# Altium project VYLT_IOT_BATTPACK.PrjPcb
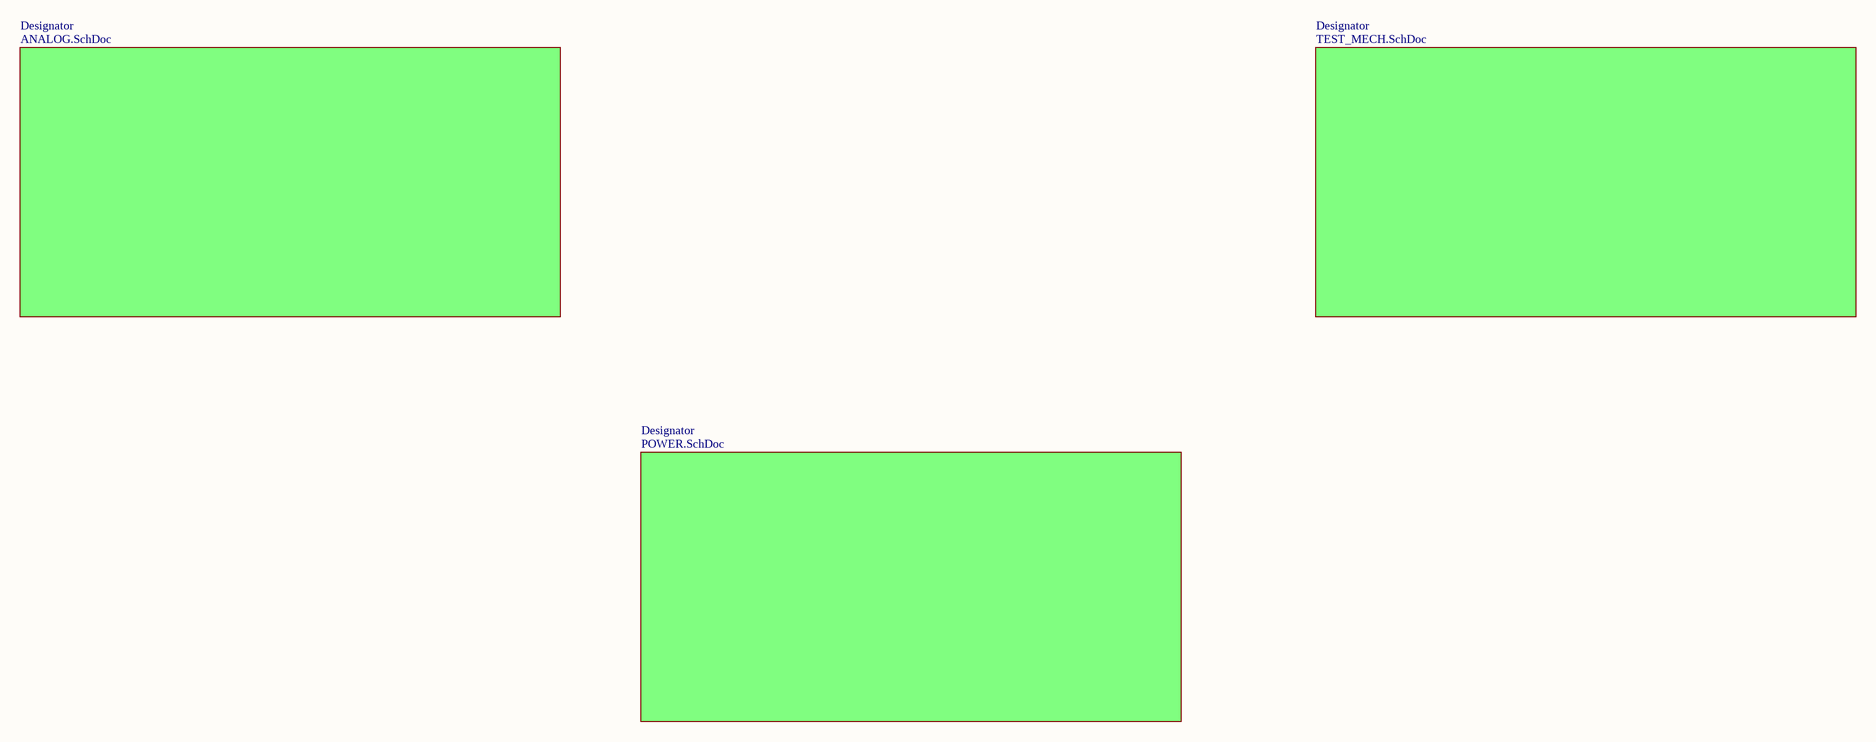
[diagram p0: ARCHITECTURE.SchDoc]
Project: VYLT_IOT_BATTPACK; Rev: 1.0; SheetTotal: 4
2 sheets, 53 parts. Net scope: global (net labels, ports and power ports of the same name join across sheets).
Board file: VYLT_IOT_BATTPACK.PcbDoc
Sheets:
  ARCHITECTURE.SchDoc
    Designator = POWER.SchDoc

## Sheet ARCHITECTURE.SchDoc: Architecture
size 420 x 297 mm; Revision: 1.0; SheetNumber: 1

### Sub-sheets
Designator = TEST_MECH.SchDoc (file not in this document): no entries
Designator = ANALOG.SchDoc (file not in this document): no entries
Designator = POWER.SchDoc: no entries

### Notes on the sheet
- PROJECT
- SIZE
- FILE NAME
- A3
- TITLE
- SHEET
- OF
- REV

## Sheet POWER.SchDoc: Power Supply
size 420 x 297 mm; Revision: 1.0; SheetNumber: 2; SheetTotal: 10
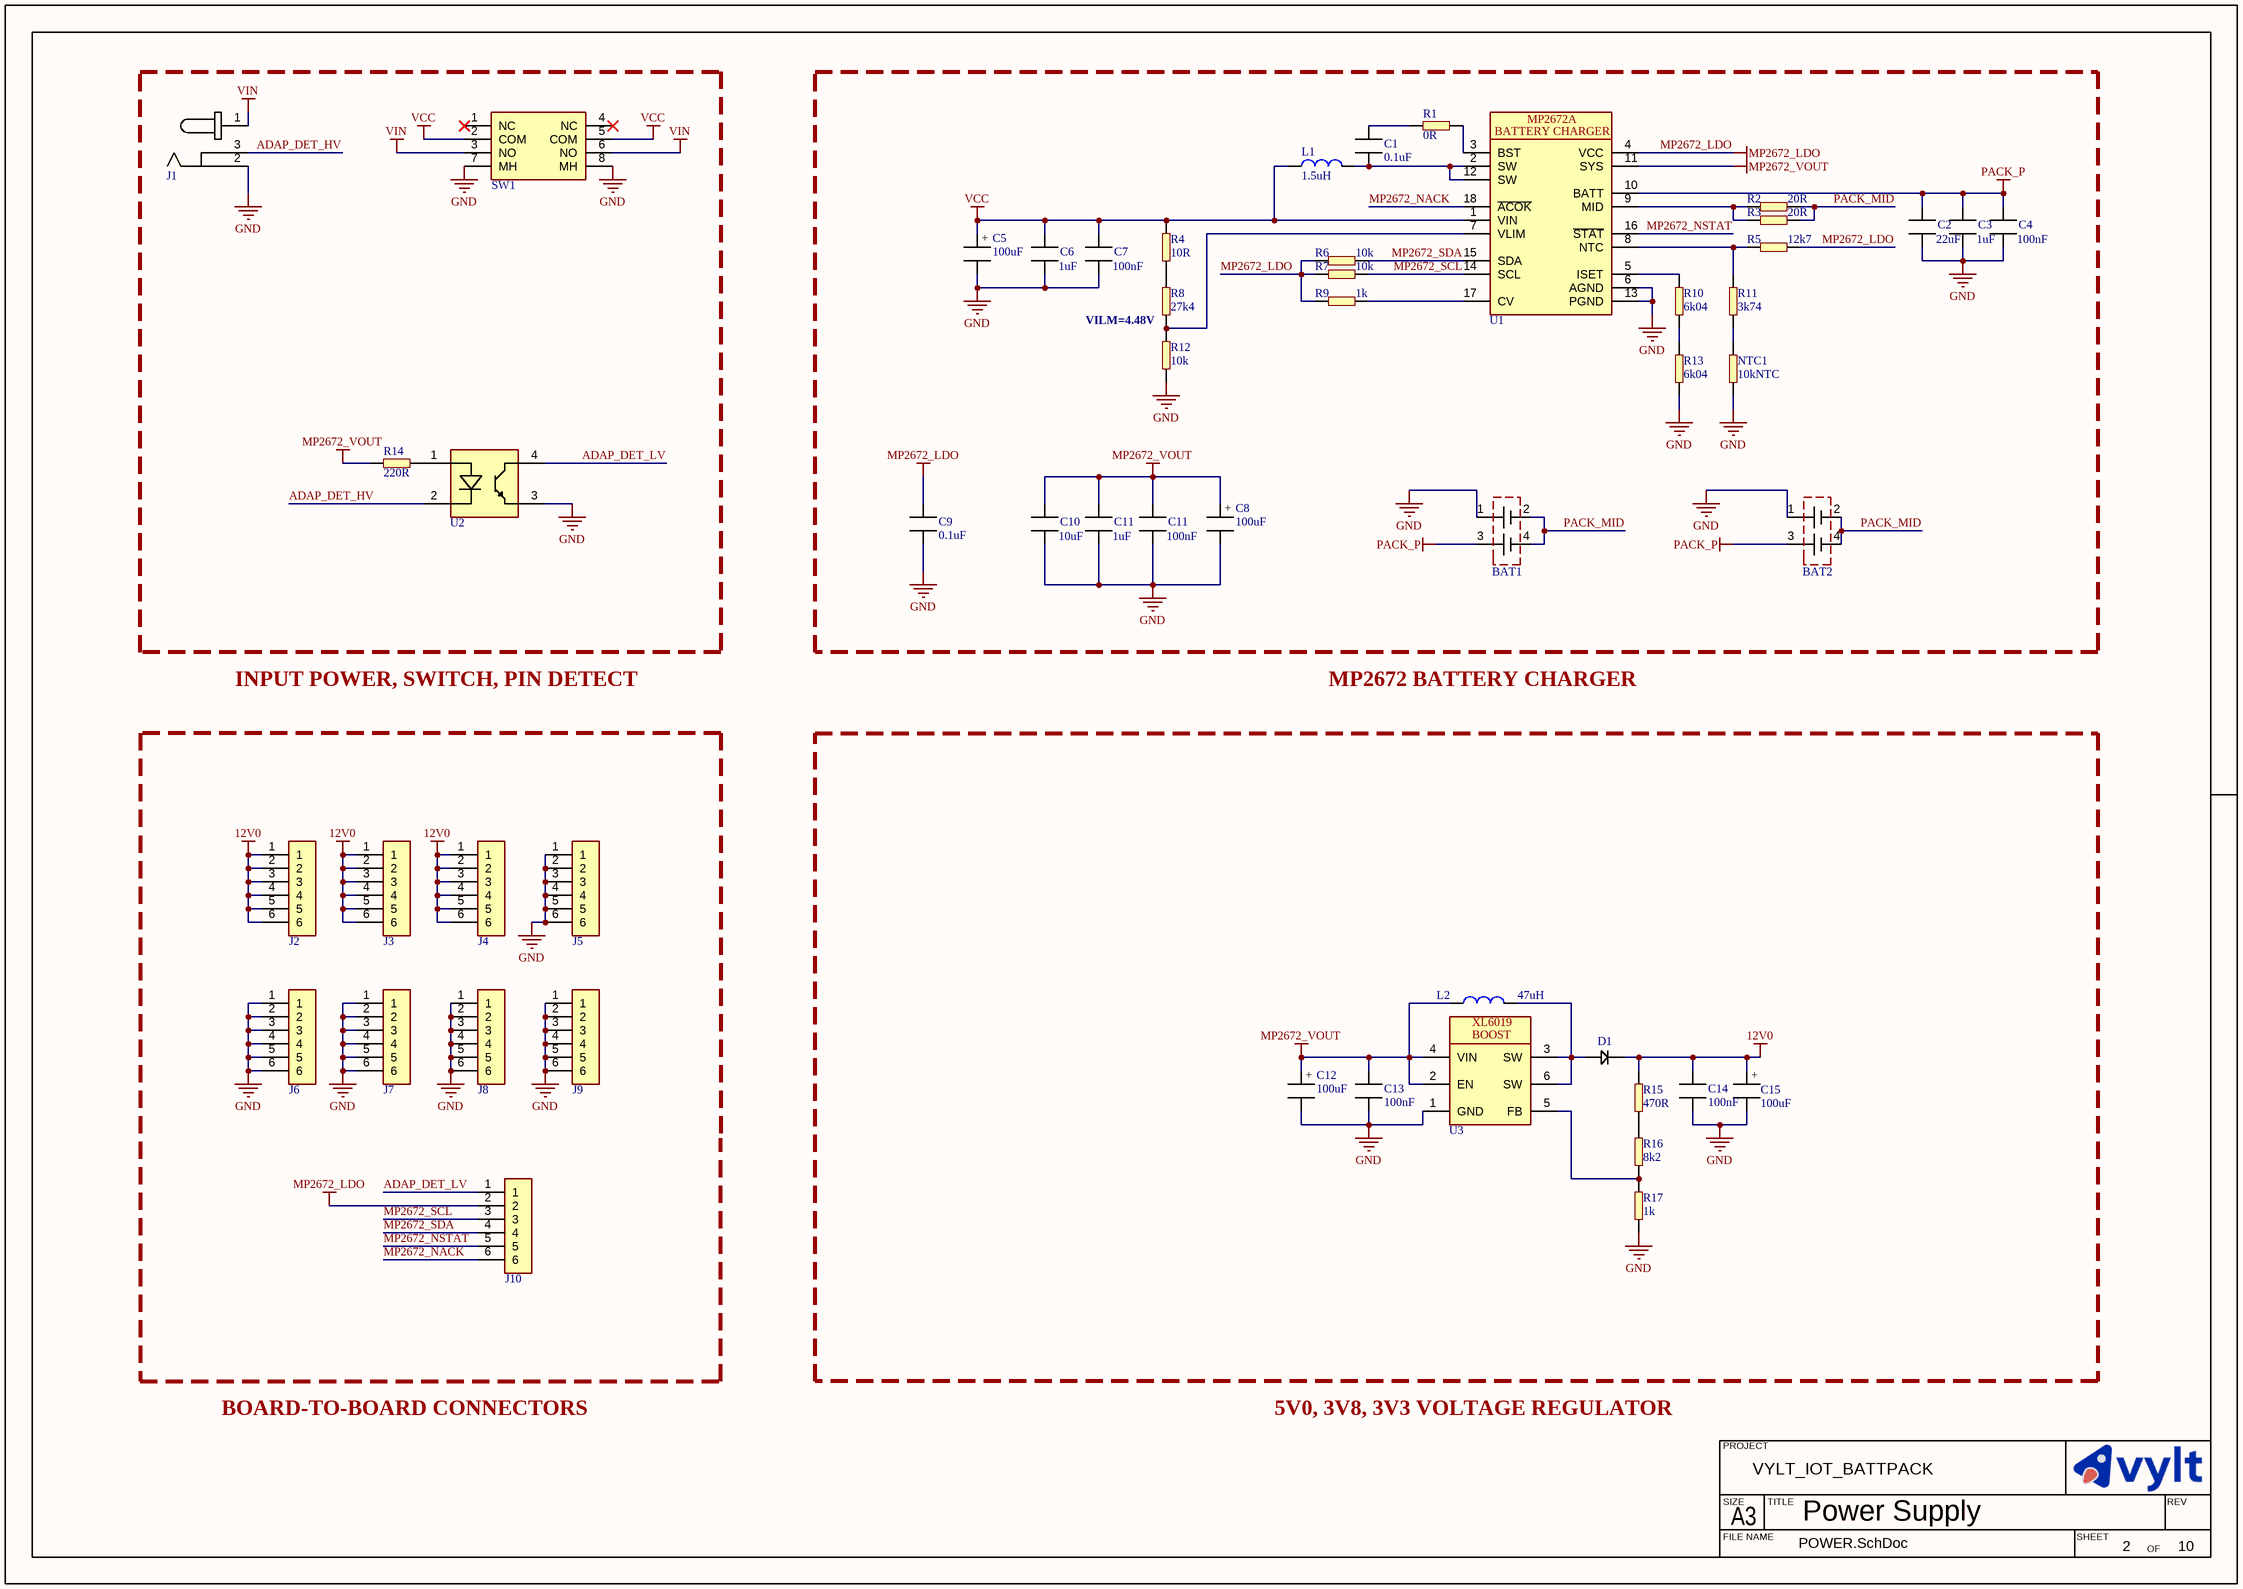
[diagram p1: POWER.SchDoc]

### Parts
(Parts that share a designator on the sheet are numbered #1, #2 ... from top to bottom, then left to right.)
BAT1  1049  [1049]  (value not drawn)
BAT2  1049  [1049]  (value not drawn)
C1  value 0.1uF  [CAPC1608X10N]  (hidden comment: MLCC_0603)
C2  value 22uF  [CAPC2012X13L]  (hidden comment: MLCC_0805)
C3  value 1uF  [CAPC2012X13L]  (hidden comment: MLCC_0805)
C4  value 100nF  [CAPC2012X13L]  (hidden comment: MLCC_0805)
C5  value 100uF  [CAP_6.3_7.7]  (hidden comment: ERP_102-2)
C6  value 1uF  [CAPC2012X13L]  (hidden comment: MLCC_0805)
C7  value 100nF  [CAPC2012X13L]  (hidden comment: MLCC_0805)
C8  value 100uF  [CAP_6.3_7.7]  (hidden comment: ERP_102-2)
C9  value 0.1uF  [CAPC1608X10N]  (hidden comment: MLCC_0603)
C10  value 10uF  [CAPC2012X13L]  (hidden comment: MLCC_0805)
C11#1  value 1uF  [CAPC2012X13L]  (hidden comment: MLCC_0805)
C11#2  value 100nF  [CAPC2012X13L]  (hidden comment: MLCC_0805)  (graphical)
C12  value 100uF  [CAP_6.3_7.7]  (hidden comment: ERP_102-2)
C13  value 100nF  [CAPC1608X10N]  (hidden comment: MLCC_0603)
C14  value 100nF  [CAPC1608X10N]  (hidden comment: MLCC_0603)
C15  value 100uF  [CAP_6.3_7.7]  (hidden comment: ERP_102-2)
D1  ERP_104-3  [DIOM6959X26L]  (value not drawn)
J1  KLDX-0202-AC  [KLDX-0202-AC]  (value not drawn)
J2  ERP_148-2  [6PX1R_F]  (value not drawn)
J3  ERP_148-2  [6PX1R_F]  (value not drawn)
J4  ERP_148-2  [6PX1R_F]  (value not drawn)
J5  ERP_148-2  [6PX1R_F]  (value not drawn)
J6  ERP_148-2  [6PX1R_F]  (value not drawn)
J7  ERP_148-2  [6PX1R_F]  (value not drawn)
J8  ERP_148-2  [6PX1R_F]  (value not drawn)
J9  ERP_148-2  [6PX1R_F]  (value not drawn)
J10  ERP_148-2  [6PX1R_F]  (value not drawn)
L1  value 1.5uH  [IND_7040]  (hidden comment: IND_7040)
L2  value 47uH  [IND_1212]  (hidden comment: IND_1212)
NTC1  value 10kNTC  [RES_NTC_BEAD]  (hidden comment: RES_NTC_BEAD)
R1  value 0R  [RES_0603]  (hidden comment: ERP_101-1)
R2  value 20R  [RESC3115X06N]  (hidden comment: ERP_101-1)
R3  value 20R  [RESC3115X06N]  (hidden comment: ERP_101-1)
R4  value 10R  [RES_0603]  (hidden comment: ERP_101-1)
R5  value 12k7  [RES_0603]  (hidden comment: ERP_101-1)
R6  value 10k  [RES_0603]  (hidden comment: ERP_101-1)
R7  value 10k  [RES_0603]  (hidden comment: ERP_101-1)
R8  value 27k4  [RES_0603]  (hidden comment: ERP_101-1)
R9  value 1k  [RES_0603]  (hidden comment: ERP_101-1)
R10  value 6k04  [RES_0603]  (hidden comment: ERP_101-1)
R11  value 3k74  [RES_0603]  (hidden comment: ERP_101-1)
R12  value 10k  [RES_0603]  (hidden comment: ERP_101-1)
R13  value 6k04  [RES_0603]  (hidden comment: ERP_101-1)
R14  value 220R  [RES_0603]  (hidden comment: ERP_101-1)
R15  value 470R  [RES_0603]  (hidden comment: ERP_101-1)
R16  value 8k2  [RES_0603]  (hidden comment: ERP_101-1)
R17  value 1k  [RES_0603]  (hidden comment: ERP_101-1)
SW1  ERP_110-4  [PBH2U]  (value not drawn)
U1  MP2672AGD  [MP2672AGD]  (value not drawn)
U2  FOD817A3SD  [FOD817A3SD]  (value not drawn)
U3  XL6019  [DPAK171P1524X483-6M]  (value not drawn)

### Blocks framed on the sheet
VILM=4.48V: BAT1 BAT2 C1-C10 C11#1 C11#2 L1 NTC1 R1-R13 U1

### Nets
12V0: C14.1 C15.1 D1.1(C) J2.1 J2.2 J2.3 J2.4 J2.5 J2.6 J3.1 J3.2 J3.3 J3.4 J3.5 J3.6 J4.1 J4.2 J4.3 J4.4 J4.5 J4.6 R15.1
GND: BAT1.1(+) BAT2.1(+) C2.2 C3.2 C4.2 C5.2 C6.2 C7.2 C8.2 C9.2 C10.2 C11#1.2 C11#2.2 C12.2 C13.2 C14.2 C15.2 J1.2 J5.1 J5.2 J5.3 J5.4 J5.5 J5.6 J6.1 J6.2 J6.3 J6.4 J6.5 J6.6 J7.1 J7.2 J7.3 J7.4 J7.5 J7.6 J8.1 J8.2 J8.3 J8.4 J8.5 J8.6 J9.1 J9.2 J9.3 J9.4 J9.5 J9.6 NTC1.1 R12.1 R13.1 R17.2 SW1.7(MH) SW1.8(MH) U1.6(AGND) U1.13(PGND) U2.3(EMITTER) U3.1(GND)
MP2672_LDO: C9.1 J10.2 R5.1 R6.1 R7.1 R9.1 U1.4(VCC)
MP2672_VOUT: C8.1 C10.1 C11#1.1 C11#2.1 C12.1 C13.1 L2.1 R14.1 U1.11(SYS) U3.2(EN) U3.4(VIN)
PACK_P: BAT1.3(+) BAT2.3(+) C2.1 C3.1 C4.1 U1.10(BATT)
VCC: C5.1 C6.1 C7.1 L1.1 R4.2 SW1.2(COM) SW1.5(COM) U1.1(VIN)
VIN: J1.1 SW1.3(NO) SW1.6(NO)
ADAP_DET_HV: J1.3 U2.2(CATHODE)
ADAP_DET_LV: J10.1 U2.4(COLLECTOR)
MP2672_NACK: J10.6 U1.18(~{ACOK})
MP2672_NSTAT: J10.5 U1.16(~{STAT})
MP2672_SCL: J10.3 R7.2 U1.14(SCL)
MP2672_SDA: J10.4 R6.2 U1.15(SDA)
PACK_MID: BAT1.2(-) BAT1.4(-) BAT2.2(-) BAT2.4(-) R2.1 R3.1
NetC1_1: C1.1 R1.1
NetC1_2: C1.2 L1.2 U1.2(SW) U1.12(SW)
NetD1_2: D1.2(A) L2.2 U3.3(SW) U3.6(SW)
NetNTC1_2: NTC1.2 R11.1
NetR1_2: R1.2 U1.3(BST)
NetR2_2: R2.2 R3.2 U1.9(MID)
NetR4_1: R4.1 R8.2
NetR5_2: R5.2 R11.2 U1.8(NTC)
NetR8_1: R8.1 R12.2 U1.7(VLIM)
NetR9_2: R9.2 U1.17(CV)
NetR10_1: R10.1 R13.2
NetR10_2: R10.2 U1.5(ISET)
NetR14_2: R14.2 U2.1(ANODE)
NetR15_2: R15.2 R16.1
NetR16_2: R16.2 R17.1 U3.5(FB)

Not connected (* = marked no-connect by the designer): SW1 1(NC)* 4(NC)*

### Notes on the sheet
- INPUT POWER, SWITCH, PIN DETECT
- MP2672 BATTERY CHARGER
- BOARD-TO-BOARD CONNECTORS
- 5V0, 3V8, 3V3 VOLTAGE REGULATOR
- PROJECT
- SIZE
- FILE NAME
- A3
- TITLE
- SHEET
- OF
- REV
- (in symbol CAP_6.3_7.7) +
- (in symbol MP2672AGD) MP2672A; BATTERY CHARGER
- (in symbol XL6019) BOOST

### Library data of the parts
BAT1 BAT2 = 1049: BATT HOLDER 18650 2 CELL PC PIN; Manufacturer 1: Keystone Electronics; Value: *; Manufacturer Part Number 1: 1049
C1 C9 C13 C14 = MLCC_0603: Chip Capacitor, 2-Leads, Body 1.60x0.80mm, IPC Medium Density; Package: 0603; Manufacturer 1: *; Manufacturer Part Number 1: *; Supplier 1: *; Suuplier Part Number 1: *; ERP: *
C2-C4 C6 C7 C10 C11#1 C11#2 = MLCC_0805: Chip Capacitor, 2-Leads, Body 2.00x1.25mm, IPC High Density; Package: 0805; Manufacturer 1: *; Manufacturer Part Number 1: *
C5 C8 = CAP_6.3_7.7: Electrolytic Capacitor SMD 6.3x7.7; ERP: 1; Package: 6.3x7.7; Manufacturer 1: *; Manufacturer Part Number 1: *; Supplier 1: *; Suuplier Part Number 1: *
C12 C15 = CAP_6.3_7.7: Electrolytic Capacitor SMD 6.3x7.7; Suuplier Part Number 1: ST2103SD1419; ERP: 1; Package: 6.3x7.7; Manufacturer 1: *; Manufacturer Part Number 1: *; Supplier 1: Sharvi
D1 = SS54: Supplier Part Number 1: ST2103SD0940; Supplier  1: Sharvi; Package: SMC; Manufacturer Part Number 1: SS54; Manufacturer 1: *; Value: *
J1 = KLDX-0202-AC: CONN PWR JACK 2X5.5MM KINKED PIN; Manufacturer 1: Sharvi; Manufacturer Part Number 1: ST2001CO0701; Value: NA
J2-J10 = 6PX1R_F: 6PX1R Female Header; Value: *; Manufacturer 1: *; Manufacturer Part Number 1: *
L1 = IND_7040: Manufacturer Part Number 1: 744311150; Manufacturer 1: Würth Elektronik
NTC1 = RES_NTC_BEAD: THERMISTOR NTC; Manufacturer 1: Eaton - Electronics Division; Manufacturer Part Number 1: NRG1104F3435B2F; Package: *
R1 R4-R17 = RES_0603: Package: 0603; Manufacturer 1: *; Manufacturer Part Number 1: *
R2 R3 = RES_1206: RES_0805; Package: 1206; Manufacturer 1: *; Manufacturer Part Number 1: *
SW1 = PBH2U: Pushbutton Switch DPDT Standard Through Hole, Right Angle; Manufacturer Part Number 1: ST2106CO3161; Manufacturer 1: Sharvi; Package: *; Value: *
U1 = MP2672AGD: 2-CELL 2A BOOST CHARGER WITH NVD; Manufacturer 1: Monolithic Power Systems Inc.; Value: *; Manufacturer Part Number 1: *
U2 = FOD817A3SD: OPTOISOLATOR 5KV TRANSISTOR 4SMD; Value: *; Manufacturer: *; Manufacturer Part Number 1: *
U3 = XL6019: 5A 180KHz 32V Boost DC to DC Converter; Manufacturer 1: XLSemi; Value: *; Manufacturer Part Number 1: XL6019; Supplier 1: Sharvi; Supplier Part Number 1: ST2103SD1714
L2 = IND_1212: Manufacturer Part Number 1: *; Manufacturer 1: *; Supplier 1: *; Supplier Part Number 1: *